# EAGLE design Un_51_V2.0 (EAGLE 7.1.0)
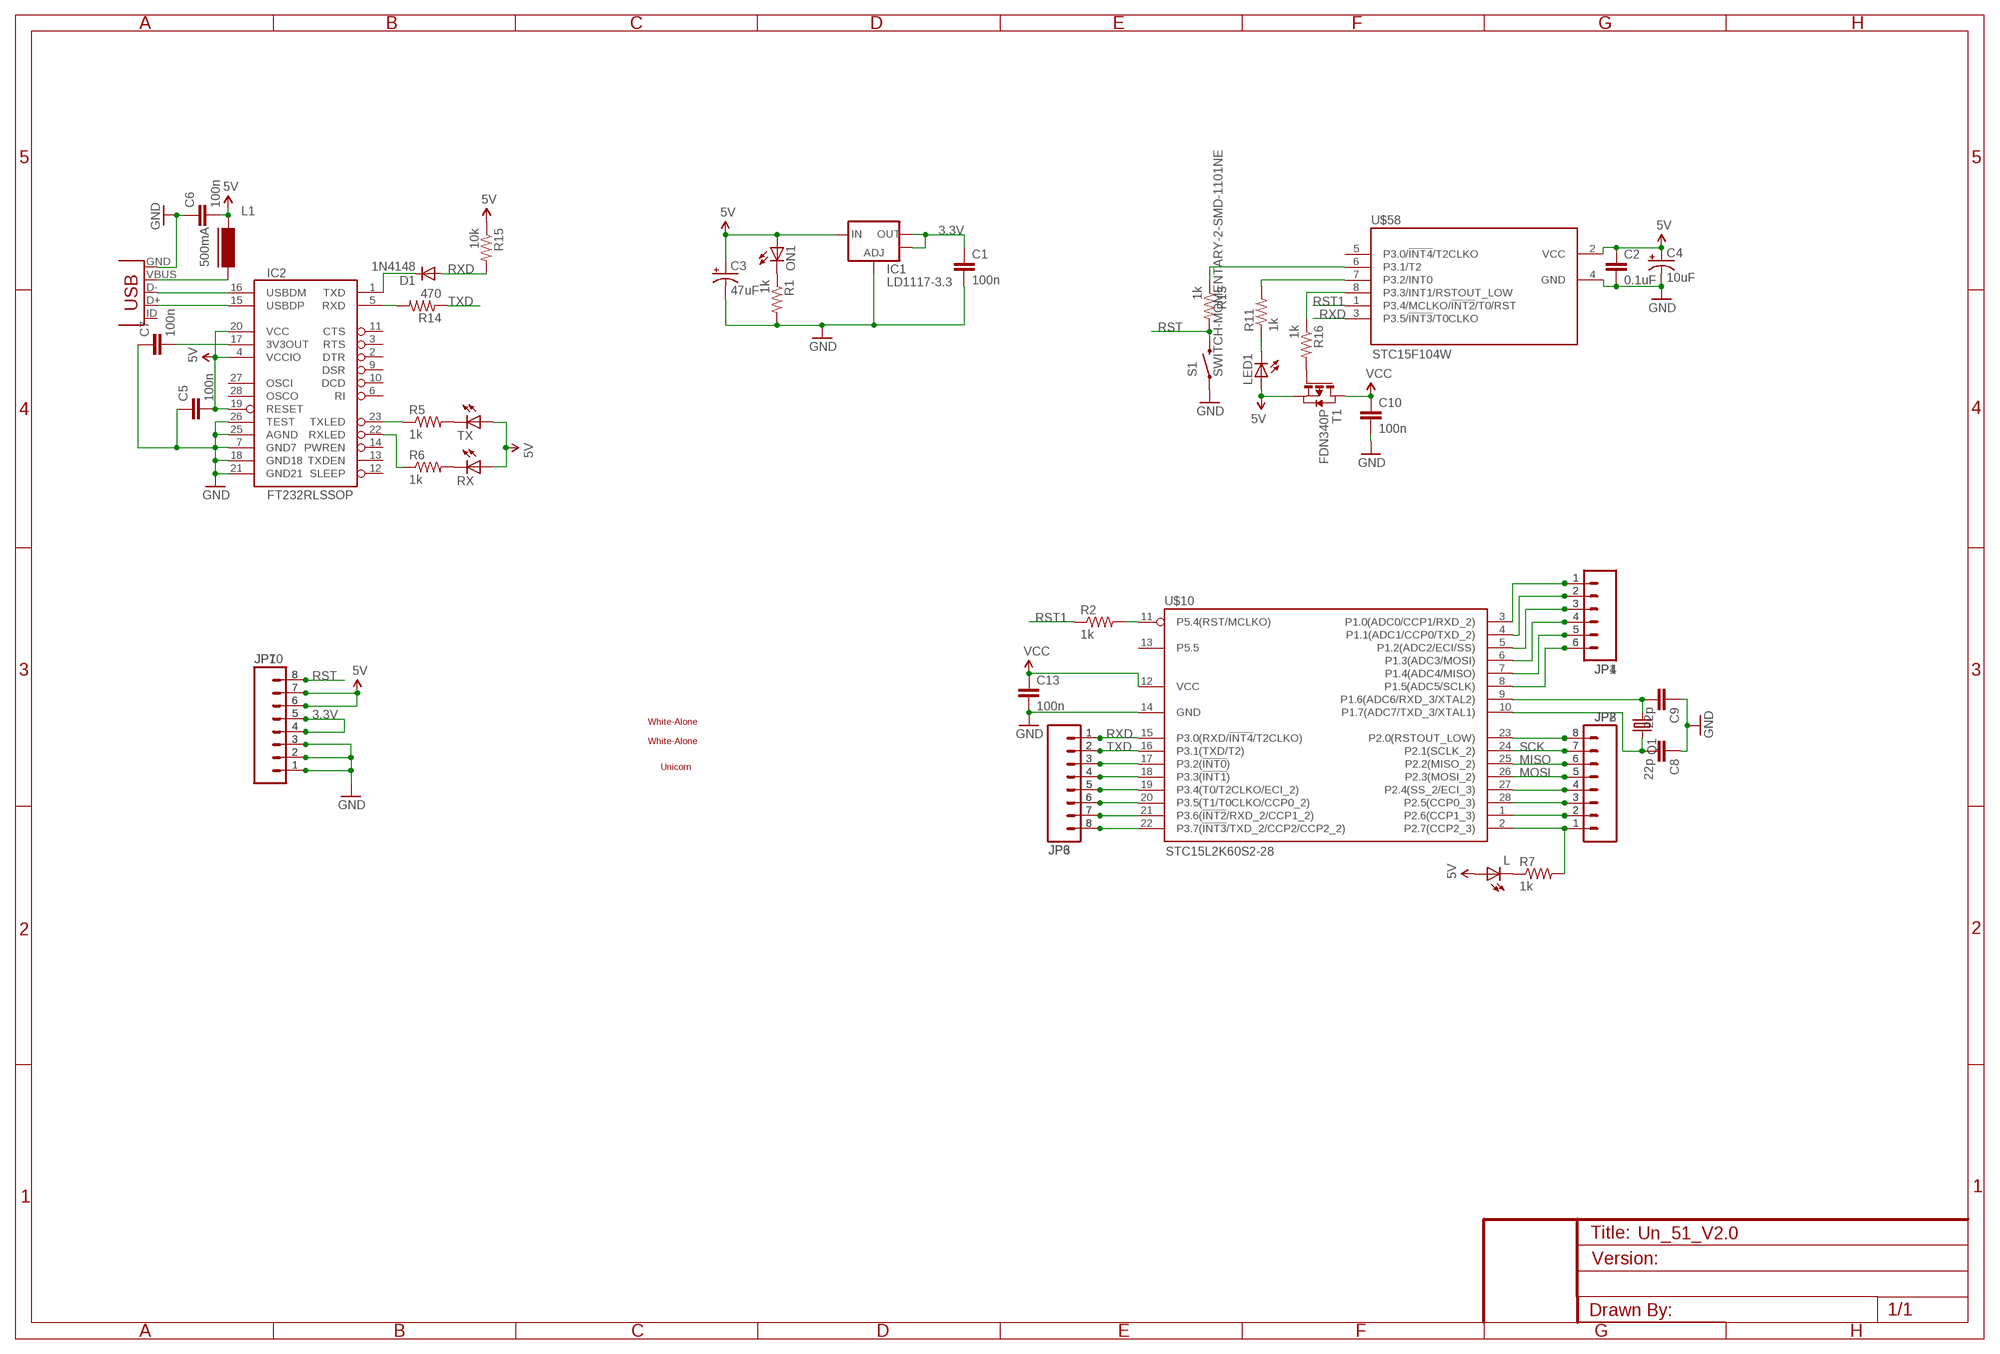
[diagram p0: schematic, sheet 1]

## Parts
C1  100n  CAP0603-CAP  [0603-CAP]
C2  0.1uF  CAP0603-CAP  [0603-CAP]
C3  47uF  CAP_POLD  [PANASONIC_D]
C4  10uF  CAP_POL1206  [EIA3216]
C5  100n  CAP0603-CAP  [0603-CAP]
C6  100n  CAP0603-CAP  [0603-CAP]
C7  100n  CAP0603-CAP  [0603-CAP]
C8  22p  CAP0603-CAP  [0603-CAP]
C9  22p  CAP0603-CAP  [0603-CAP]
C10  100n  CAP0603-CAP  [0603-CAP]
C13  100n  CAP0603-CAP  [0603-CAP]
D1  1N4148  DIODESOD  [SOD-323]
IC1  LD1117-3.3  V_REG_LM1117SOT223  [SOT223]
IC2  FT232RLSSOP  [SSOP28DB]
JP1  M06SIP  [1X06]
JP2  M08  [1X08]
JP3  M08  [1X08]
JP4  M06SIP  [1X06]
JP6  M08  [1X08]
JP7  M08  [1X08]
JP8  M08  [1X08]
JP10  M08  [1X08]
L  LED0805  [LED-0805]
L1  500mA  FERRITE-0805  [FB805]
LED1  LED0805  [LED-0805]
ON1  LED0805  [LED-0805]
Q1  CRYSTALHC49US  [HC49US]
R1  1k  RESISTOR0603-RES  [0603-RES]
R2  1k  RESISTOR0603-RES  [0603-RES]
R5  1k  RESISTOR0603-RES  [0603-RES]
R6  1k  RESISTOR0603-RES  [0603-RES]
R7  1k  RESISTOR0603-RES  [0603-RES]
R11  1k  RESISTOR0603-RES  [0603-RES]
R13  1k  RESISTOR0603-RES  [0603-RES]
R14  470  RESISTOR0603-RES  [0603-RES]
R15  10k  RESISTOR0603-RES  [0603-RES]
R16  1k  RESISTOR0603-RES  [0603-RES]
RX  LED0805  [LED-0805]
S1  SWITCH-MOMENTARY-2-SMD-1101NE  [TACTILE-SWITCH-1101NE]
T1  FDN340P  PMOSSOT23  [SOT-23]
TX  LED0805  [LED-0805]
U$3  UNICORN_1  [UNICORN_1]
U$7  WHITE-ALONE_0  [WHITE-ALONE_0]
U$10  STC15L2K60S2-28  [SO-28W]
U$11  WHITE-ALONE_0  [WHITE-ALONE_0]
U$58  STC15F104W  [SO08]
X2  USBSMD  [USB-MINIB]

## Nets
3.3V: C1.1 IC1.2(OUT) IC1.4(OUT) JP7.4 JP7.5 JP10.4 JP10.5
5V [usbvcc]: C2.1 C3.+ C4.A(+) C5.2 C6.2 IC1.3(IN) IC2.4(VCCIO) IC2.19(RESET) IC2.20(VCC) JP7.6 JP7.7 JP10.6 JP10.7 L1.1 L.1(A) LED1.1(A) ON1.1(A) R15.1 RX.1(A) T1.2(S) TX.1(A) U$58.2(VCC)
GND [gnd]: C1.2 C2.2 C3.- C4.C(-) C5.1 C6.1 C7.1 C8.1 C9.1 C10.2 C13.2 IC1.1(ADJ) IC2.7(GND7) IC2.18(GND18) IC2.21(GND21) IC2.25(AGND) IC2.26(TEST) JP7.1 JP7.2 JP7.3 JP10.1 JP10.2 JP10.3 R1.2 S1.P$1 U$10.14(GND) U$58.4(GND) X2.GND
MISO: JP2.6 JP8.6 U$10.25(P2.2(MISO_2))
MOSI: JP2.5 JP8.5 U$10.26(P2.3(MOSI_2))
N$1: JP1.6 JP4.6 U$10.8(P1.5(ADC5/SCLK))
N$2: JP1.5 JP4.5 U$10.7(P1.4(ADC4/MISO))
N$3: L1.2 X2.VBUS
N$4: LED1.2(C) R11.1
N$5: IC2.16(USBDM) X2.D-
N$6: IC2.15(USBDP) X2.D+
N$7: IC2.23(TXLED) R5.1
N$8: R5.2 TX.2(C)
N$9: R6.2 RX.2(C)
N$10: IC2.22(RXLED) R6.1
N$11: JP3.8 JP6.8 U$10.22(P3.7(!INT3!/TXD_2/CCP2/CCP2_2))
N$12: JP1.4 JP4.4 U$10.6(P1.3(ADC3/MOSI))
N$13: JP1.3 JP4.3 U$10.5(P1.2(ADC2/ECI/SS))
N$14: JP1.2 JP4.2 U$10.4(P1.1(ADC1/CCP0/TXD_2))
N$15: JP3.7 JP6.7 U$10.21(P3.6(!INT2!/RXD_2/CCP1_2))
N$16: JP2.8 JP8.8 U$10.23(P2.0(RSTOUT_LOW))
N$17: JP1.1 JP4.1 U$10.3(P1.0(ADC0/CCP1/RXD_2))
N$18: JP2.2 JP8.2 U$10.1(P2.6(CCP1_3))
N$19: JP2.1 JP8.1 R7.2 U$10.2(P2.7(CCP2_3))
N$20: R11.2 U$58.7(P3.2/INT0)
N$21: L.2(C) R7.1
N$22: C7.2 IC2.17(3V3OUT)
N$23: R2.2 U$10.11(P5.4(RST/MCLKO))
N$24: JP3.3 JP6.3 U$10.17(P3.2(!INT0!))
N$25: JP3.4 JP6.4 U$10.18(P3.3(!INT1!))
N$26: JP3.5 JP6.5 U$10.19(P3.4(T0/T2CLKO/ECI_2))
N$27: JP3.6 JP6.6 U$10.20(P3.5(T1/T0CLKO/CCP0_2))
N$28: R16.1 U$58.8(P3.3/INT1/RSTOUT_LOW)
N$29: JP2.3 JP8.3 U$10.28(P2.5(CCP0_3))
N$31: ON1.2(C) R1.1
N$32: R13.1 U$58.6(P3.1/T2)
N$35: IC2.5(RXD) R14.2
N$37: D1.1(C) IC2.1(TXD)
N$39: C8.2 Q1.2 U$10.10(P1.7(ADC7/TXD_3/XTAL1))
N$40: C9.2 Q1.1 U$10.9(P1.6(ADC6/RXD_3/XTAL2))
N$41: R16.2 T1.3(G)
N$48: JP2.4 JP8.4 U$10.27(P2.4(SS_2/ECI_3))
RST: JP7.8 JP10.8 R13.2 S1.P$2
RST1: R2.1 U$58.1(P3.4/MCLKO/!INT2!/T0/RST)
RXD: D1.2(A) JP3.1 JP6.1 R15.2 U$10.15(P3.0(RXD/!INT4!/T2CLKO)) U$58.3(P3.5/!INT3!/T0CLKO)
SCK: JP2.7 JP8.7 U$10.24(P2.1(SCLK_2))
TXD: JP3.2 JP6.2 R14.1 U$10.16(P3.1(TXD/T2))
VCC [power]: C10.1 C13.1 T1.1(D) U$10.12(VCC)
Unconnected: IC2.2(DTR) IC2.3(RTS) IC2.6(RI) IC2.9(DSR) IC2.10(DCD) IC2.11(CTS) IC2.12(SLEEP) IC2.13(TXDEN) IC2.14(PWREN) IC2.27(OSCI) IC2.28(OSCO) U$10.13(P5.5) U$58.5(P3.0/!INT4!/T2CLKO) X2.ID(USBID)

## Library data of the parts
C1 C2 C5-C10 = 2SparkFun:CAP: Capacitor Standard 0603 ceramic capacitor, and 0.1" leaded capacitor.
C3 C4 = 2SparkFun:CAP_POL: Capacitor Polarized These are standard SMD and PTH capacitors. Normally 10uF, 47uF, and 100uF in electrolytic and tantalum varieties. Always verify the external diameter of the through hole cap, it varies with capacity, voltage, and manufacturer. The EIA devices should be standard.
C13 = 1SparkFun:CAP: Capacitor Standard 0603 ceramic capacitor, and 0.1" leaded capacitor.
D1 = 2SparkFun:DIODE: Diode These are standard reverse protection diodes and small signal diodes. SMA package can handle up to about 1A. SOD-323 can handle about 200mA. What the SOD-323 package when ordering, there are some mfgs out there that are 5-pin packages.
IC1 = 1SparkFun:V_REG_LM1117: Voltage Regulator LM1117 Standard adjustable voltage regulator but in SMD form. Spark Fun Electronics SKU : COM-00595
IC2 = 1SparkFun:FT232RL: USB UART FT232RL 4th Generation USB UART (USB <-> Serial) Controller. Spark Fun Electronics SKU : COM-00650
JP1 JP4 = 2SparkFun:M06: Header 6 Standard 6-pin 0.1" header. Use with straight break away headers (SKU : PRT-00116), right angle break away headers (PRT-00553), swiss pins (PRT-00743), machine pins (PRT-00117), and female headers (PRT-00115). Molex polarized connector foot print use with SKU : PRT-08094 with associated crimp pins and housings. NOTES ON THE VARIANTS LOCK and LOCK_LONGPADS... This footprint was designed to help hold the alignment of a through-hole component (i.e. 6-pin header) while soldering it into place. You may notice that each hole has been shifted either up or down by 0.005 of an inch from it's more standard position (which is a perfectly straight line). This slight alteration caused the pins (the squares in the middle) to touch the edges of the holes. Because they are alternating, it causes a "brace" to hold the component in place. 0.005 has proven to be the perfect amount of "off-center" position when using our standard breakaway headers. Although looks a little odd when you look at the bare footprint, once you have a header in there, the alteration is very hard to notice. Also, if you push a header all the way into place, it is covered up entirely on the bottom side. This idea of altering the position of holes to aid alignment will be further integrated into the Sparkfun Library for other footprints. It can help hold any component with 3 or more connection pins.
JP2 JP3 JP6-JP8 JP10 = 1SparkFun:M08: Header 8 Standard 8-pin 0.1" header. Use with straight break away headers (SKU : PRT-00116), right angle break away headers (PRT-00553), swiss pins (PRT-00743), machine pins (PRT-00117), and female headers (PRT-00115).
L ON1 RX TX = 1SparkFun:LED: LEDs Standard schematic elements and footprints for 5mm, 3mm, 1206, and 0603 sized LEDs. 5mm - Spark Fun Electronics SKU : COM-00529 (and others)
L1 = 2SparkFun:FERRITE: Ferrite bead in various packages
LED1 = 2SparkFun:LED: LEDs Standard schematic elements and footprints for 5mm, 3mm, 1206, and 0603 sized LEDs. 5mm - Spark Fun Electronics SKU : COM-00529 (and others)
Q1 = 1SparkFun:CRYSTAL: Crystals Various standard crystals. Proven footprints. Spark Fun Electronics SKU : COM-00534
R1 R2 R5-R7 R11 R13-R16 = 2SparkFun:RESISTOR: Resistor Basic schematic elements and footprints for 0603, 1206, and PTH resistors.
S1 = 2SparkFun:SWITCH-MOMENTARY-2
T1 = zetex:PMOSSOT23: MOS FET; OC_FARNELL: unknown; OC_NEWARK: unknown
U$3 = 2SparkFun:UNICORN
U$7 U$11 = 2SparkFun:WHITE-ALONE
U$10 = 2SparkFun:STC15L2K60S2-28
U$58 = 2SparkFun:STC15F104W
X2 = 2SparkFun:USB: USB Connectors USB-B-PTH is fully proven SKU : PRT-00139 USB-miniB is fully proven SKU : PRT-00587 USB-A-PCB is untested. USB-A-H is throughly reviewed, but untested. Spark Fun Electronics SKU : PRT-00437 USB-B-SMT is throughly reviewed, but untested. Needs silkscreen touching up. USB-A-S has not been used/tested USB-MB-H has not been used/tested

## Net classes
0 default: width 0.254 mm, clearance 0.254 mm
1 power: width 0.61 mm, drill 0.61 mm, clearance 0.254 mm
2 gnd: width 0.305 mm, drill 0.381 mm, clearance 0.254 mm
3 usbvcc: width 0.508 mm, drill 0.61 mm, clearance 0.254 mm
4 aref: width 0.406 mm, drill 0.61 mm, clearance 0.254 mm

## Board
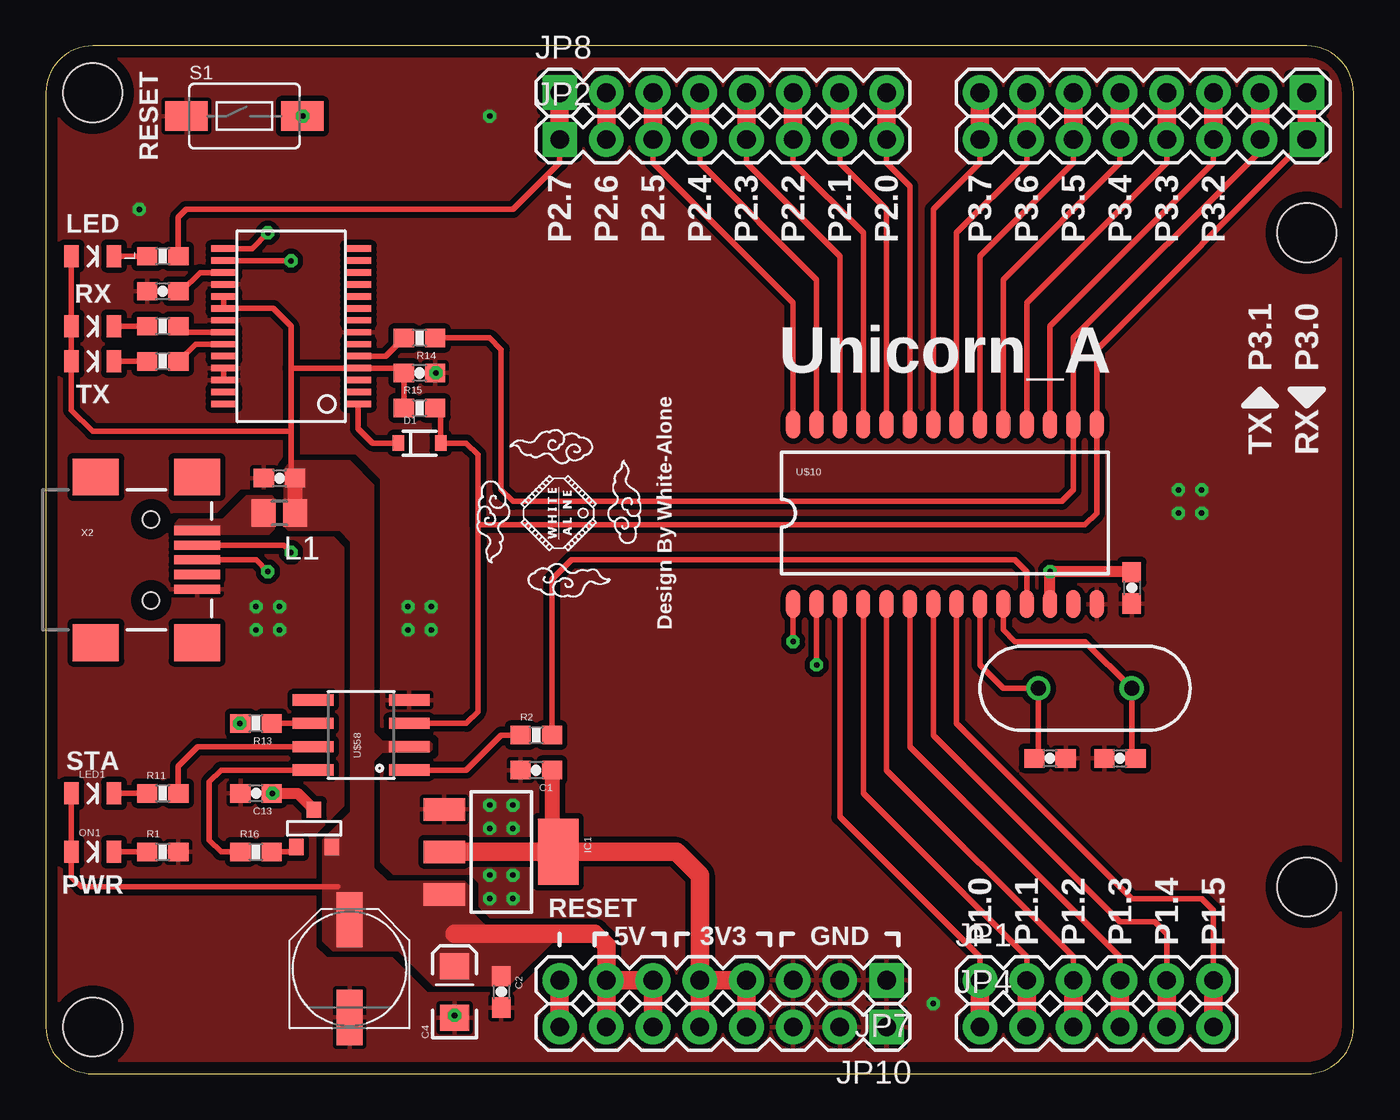
[diagram p1: board, top side]
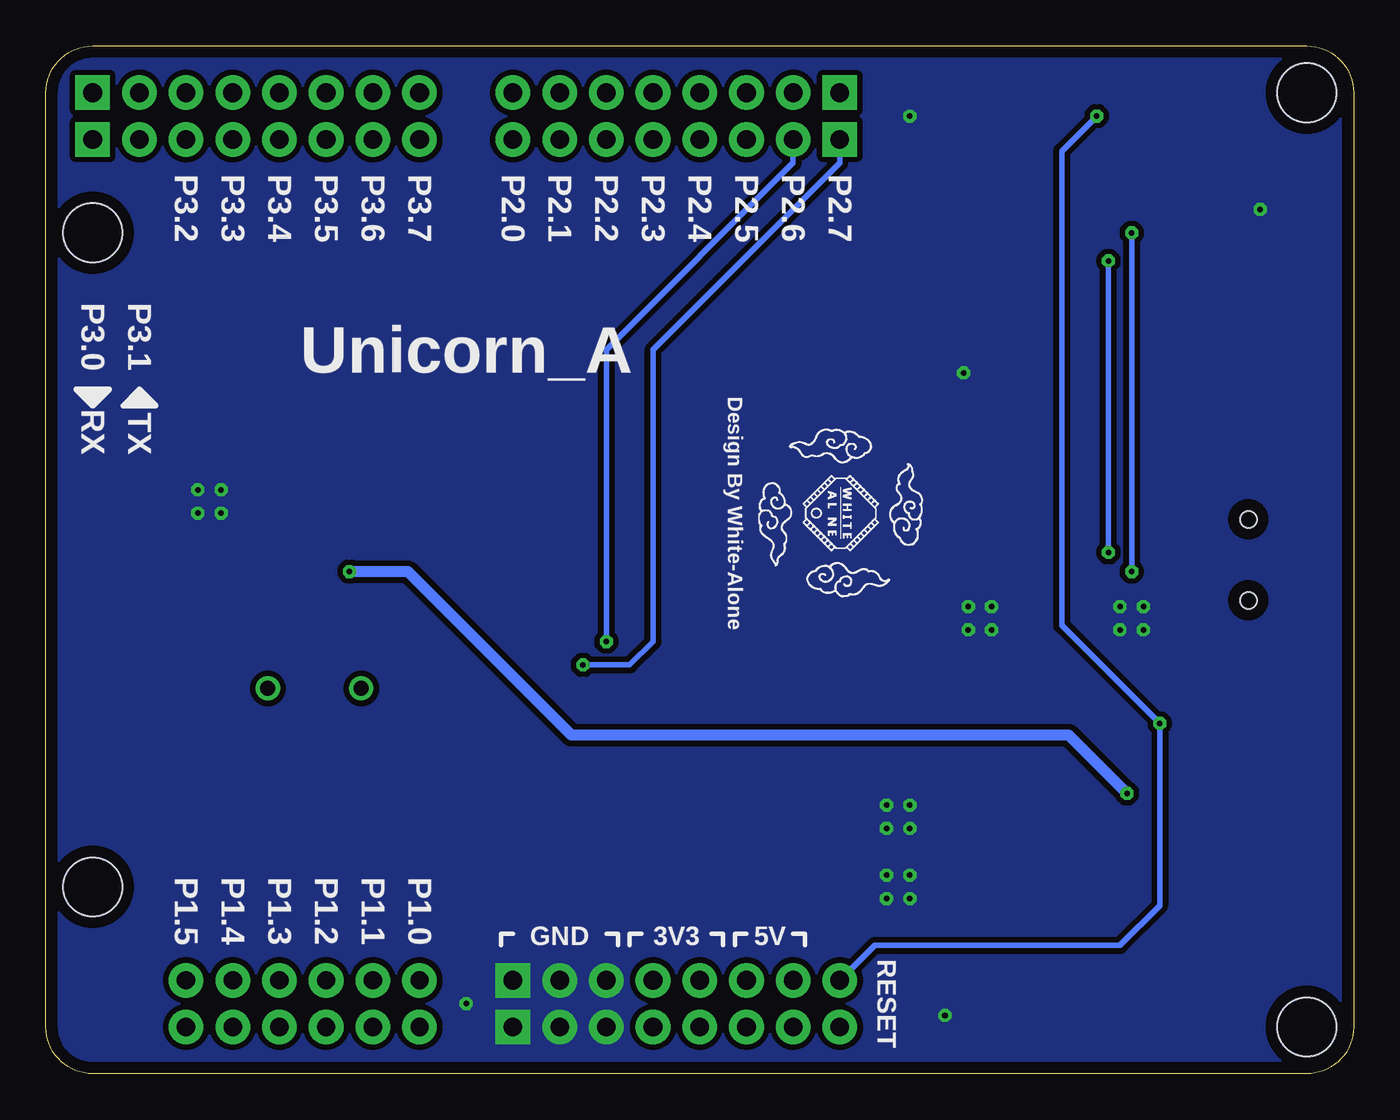
[diagram p2: board, bottom side, seen from below]

Size 71.12 x 55.88 mm. Coordinates in mm from the lower left corner, seen from the top.
Copper layers (1*16): Top 0.035mm / dielectric 1.5mm / Bottom 0.035mm
Design rules "yun": minimum track width 8mil, minimum drill 15mil, track to track 8mil, track to pad 8mil, pad to pad 8mil, via to via 8mil, smd to smd 8mil, copper to edge 25mil, drill to drill 8mil, minimum pad ring 10mil, minimum via ring 8mil, stop-mask expansion 4mil, vias tented up to drill 20mil, thermal gap 8mil

### Footprints (pad centres in the part's own frame; a part is rotated, then mirrored left to right if it is on the bottom)
0603-CAP = smd 1.1 x 1: 1 -0.85,0; 2 0.85,0
PANASONIC_D = smd 3 x 1.4: + 2.654,0; - -2.654,0
EIA3216 = smd 1.4 x 1.6: A 1.4,0; C -1.4,0
SOD-323 = smd 0.63 x 0.83: 1 -1.15,0; 2 1.15,0
SOT223 = smd 1.219 x 2.235: 1 -2.311,-3.099; 2 0,-3.099; 3 2.311,-3.099 | smd 3.6 x 2.2: 4 0,3.099
SSOP28DB = smd 0.348 x 1.397: 1 -4.225,-3.656; 2 -3.575,-3.656; 3 -2.925,-3.656; 4 -2.275,-3.656; 5 -1.625,-3.656; 6 -0.975,-3.656; 7 -0.325,-3.656; 8 0.325,-3.656; 9 0.975,-3.656; 10 1.625,-3.656; 11 2.275,-3.656; 12 2.925,-3.656; 13 3.575,-3.656; 14 4.225,-3.656; 15 4.225,3.656; 16 3.575,3.656; 17 2.925,3.656; 18 2.275,3.656; 19 1.625,3.656; 20 0.975,3.656; 21 0.325,3.656; 22 -0.325,3.656; 23 -0.975,3.656; 24 -1.625,3.656; 25 -2.275,3.656; 26 -2.925,3.656; 27 -3.575,3.656; 28 -4.225,3.656
1X06 = drill 1 pad 1.88: 1 0,0; 2 2.54,0; 3 5.08,0; 4 7.62,0; 5 10.16,0; 6 12.7,0
1X08 = drill 1.016 pad 1.88 square: 1 0,0 | drill 1.016 pad 1.88: 2 2.54,0; 3 5.08,0; 4 7.62,0; 5 10.16,0; 6 12.7,0; 7 15.24,0; 8 17.78,0
LED-0805 = smd 0.8 x 1.2: 1 -1.154,0; 2 1.154,0
FB805 = smd 1.3 x 1.5: 1 -0.85,0; 2 0.85,0
HC49US = drill 0.813: 1 -2.54,0; 2 2.54,0
0603-RES = smd 1.1 x 1: 1 -0.85,0; 2 0.85,0
TACTILE-SWITCH-1101NE = smd 2.3 x 1.6: P$1 -3.15,0; P$2 3.15,0
SOT-23 = smd 0.787 x 0.889: 1 0.025,-1.016; 2 -0.94,1.016; 3 0.991,1.016
UNICORN_1 = hole 3.2: -33.02,-25.4; 33.02,17.78; 33.02,-17.78; -33.02,25.4
SO-28W = smd 0.762 x 1.524: 1 -8.255,-4.953; 2 -6.985,-4.953; 3 -5.715,-4.953; 4 -4.445,-4.953; 5 -3.175,-4.953; 6 -1.905,-4.953; 7 -0.635,-4.953; 8 0.635,-4.953; 9 1.905,-4.953; 10 3.175,-4.953; 11 4.445,-4.953; 12 5.715,-4.953; 13 6.985,-4.953; 14 8.255,-4.953; 15 8.255,4.826; 16 6.985,4.826; 17 5.715,4.826; 18 4.445,4.826; 19 3.175,4.826; 20 1.905,4.826; 21 0.635,4.826; 22 -0.635,4.826; 23 -1.905,4.826; 24 -3.175,4.826; 25 -4.445,4.826; 26 -5.715,4.826; 27 -6.985,4.826; 28 -8.255,4.826
SO08 = smd 0.61 x 2.21: 1 -1.905,-2.616; 2 -0.635,-2.616; 3 0.635,-2.616; 4 1.905,-2.616; 5 1.905,2.616; 6 0.635,2.616; 7 -0.635,2.616; 8 -1.905,2.616
USB-MINIB = smd 2.5 x 0.5: D+ 2.5,0; D- 2.5,0.8; GND 2.5,-1.6; ID 2.5,-0.8; VBUS 2.5,1.6 | smd 2.5 x 2: MTN1 -3,4.5; MTN2 2.5,4.5; MTN3 -3,-4.5; MTN4 2.5,-4.5 | hole 0.9: 0,2.2; 0,-2.2

### Placement (x,y rotation side)
C1  26.67,16.51 180 top
C2  24.77,4.45 270 top
C3  16.51,5.71 90 top
C4  22.23,4.45 90 top
C5  20.32,38.1 180 top
C6  12.7,32.38 0 top
C7  6.35,42.55 0 top
C8  58.42,17.14 0 top
C9  54.61,17.14 180 top
C10  59.05,26.42 270 top
C13  11.43,15.24 180 top
D1  20.32,34.29 0 top
IC1  24.77,12.06 270 top
IC2  13.34,40.64 90 top
JP1  50.8,5.08 0 top
JP2  27.94,50.8 0 top
JP3  68.58,53.34 180 top
JP4  50.8,2.54 0 top
JP6  68.58,50.8 180 top
JP7  45.72,5.08 180 top
JP8  27.94,53.34 0 top
JP10  45.72,2.54 180 top
L  2.54,44.45 0 top
L1  12.7,30.48 180 top
LED1  2.54,15.24 0 top
ON1  2.54,12.06 0 top
Q1  56.52,20.95 0 top
R1  6.35,12.06 0 top
R2  26.67,18.41 0 top
R5  6.35,38.73 180 top
R6  6.35,40.64 180 top
R7  6.35,44.45 0 top
R11  6.35,15.24 0 top
R13  11.43,19.05 180 top
R14  20.32,40.01 180 top
R15  20.32,36.2 0 top
R16  11.43,12.06 0 top
RX  2.54,40.64 0 top
S1  10.79,52.07 0 top
T1  14.61,13.34 180 top
TX  2.54,38.73 0 top
U$3  35.56,27.94 0 top
U$7  27.94,30.48 90 top
U$10  48.9,30.48 0 top
U$11  27.94,30.48 270 bottom
U$58  17.14,18.41 90 top
X2  5.71,27.94 0 top

### Tracks (layer width: path | path; a pad name or v marks a point on that pad's centre or on a via)
3.3V
  Top 0.813: C1.1 27.52,12.28 27.3,12.06
  Top 1.016: IC1.2 27.3,12.06 IC1.4 34.29,12.06 35.56,10.79 JP7.5 | JP7.5 JP7.4 JP10.4 | JP10.5 JP7.5
5V
  Top 0.305: R15.1 C5.2 19.2,38.37 IC2.4 13.34,38.37 | IC2.19 IC2.20 12.36,41.62 13.34,40.64 13.34,38.37 | L.1 RX.1 TX.1 1.39,36.08 2.54,34.92 13.34,34.92 | 13.34,38.37 13.34,34.92 | 13.34,34.92 13.34,32.6 C6.2 | LED1.1 ON1.1 1.39,10.68 1.91,10.16 15.88,10.16
  Top 0.813: L1.1 C6.2
  Top 1.016: JP10.6 JP7.6 JP7.7 | JP10.7 JP7.7 | JP7.7 30.48,6.99 29.84,7.62 22.23,7.62
  pour Top (isolate 0.305, no thermals): 15.62,6.73 19.18,6.73 21.08,4.83 25.15,4.83 27.81,7.49 27.81,8 23.88,8 23.11,8.76 23.11,10.03 22.73,10.41 18.54,10.41 17.78,11.18 17.78,17.02 18.29,17.53 20.83,17.53 20.95,17.65 20.95,17.91 20.83,18.03 18.29,18.03 17.78,18.54 17.78,32 16.51,33.27 13.34,33.27 13,32.84 13,29.79 13.21,29.59 16,29.59 16.64,28.96 16.64,14.22 15.11,12.7 15.11,7.24
GND  (via drill 0.3)
  Top 0.305: IC2.25 IC2.26
  other vias: 22.23,3.17 24.13,13.34 25.4,13.34 24.13,10.79 25.4,10.79 21.21,38.1 24.13,14.61 25.4,14.61 24.13,9.53 25.4,9.53 24.13,52.07 48.26,3.81 61.59,31.75 62.87,30.48 61.59,30.48 5.08,46.99 11.43,25.4 12.7,25.4 11.43,24.13 12.7,24.13 19.68,24.13 20.95,24.13 20.95,25.4 19.68,25.4 62.87,31.75
  pour Bottom (isolate 0.305, rank 2, no thermals): 0,0 71.12,0 71.12,55.88 0,55.88
  pour Top (isolate 0.305, rank 2): 0,0 71.12,0 71.12,55.88 0,55.88
MISO
  Top 0.305: U$10.25 44.45,45.72 40.64,49.53 JP2.6
  Top 1.016: JP2.6 JP8.6
MOSI
  Top 0.305: U$10.26 43.18,44.45 38.1,49.53 JP2.5
  Top 1.016: JP2.5 JP8.5
N$1
  Top 0.305: U$10.8 49.53,19.05 59.05,9.53 62.87,9.53 63.5,8.89 JP1.6
  Top 1.016: JP4.6 JP1.6
N$2
  Top 0.305: U$10.7 48.26,18.41 58.42,8.26 60.33,8.26 60.96,7.62 JP1.5
  Top 1.016: JP4.5 JP1.5
N$3
  pour Top (isolate 0.305, no thermals): 7.09,29.39 12.12,29.39 12.37,29.64 12.4,31.24 12.27,31.37 10.92,31.37 9.65,30.1 7.24,30.1 7.09,29.9
N$4
  Top 0.305: LED1.2 R11.1
N$5  (via drill 0.3)
  Top 0.305: IC2.16 13.32,44.22 v13.34,44.2 | X2.D- 12.94,28.74 v13.34,28.35
  Bottom 0.305: v13.34,28.35 v13.34,44.2
N$6  (via drill 0.3)
  Top 0.305: X2.D+ 11.43,27.94 v12.06,27.3 | IC2.15 11.21,44.87 v12.06,45.72
  Bottom 0.305: v12.06,27.3 v12.06,45.72
N$7
  Top 0.305: IC2.23 8.13,39.66 R5.1
N$8
  Top 0.305: TX.2 R5.2
N$9
  Top 0.305: RX.2 R6.2
N$10
  Top 0.305: IC2.22 7.53,40.31 R6.1
N$11
  Top 0.305: U$10.22 48.26,46.99 50.8,49.53 JP6.8
  Top 1.016: JP3.8 JP6.8
N$12
  Top 0.305: U$10.6 46.99,17.78 58.42,6.35 JP1.4
  Top 1.016: JP4.4 JP1.4
N$13
  Top 0.305: U$10.5 45.72,16.51 55.88,6.35 JP1.3
  Top 1.016: JP4.3 JP1.3
N$14
  Top 0.305: U$10.4 44.45,15.24 53.34,6.35 JP1.2
  Top 1.016: JP4.2 JP1.2
N$15
  Top 0.305: U$10.21 49.53,45.72 53.34,49.53 JP6.7
  Top 1.016: JP3.7 JP6.7
N$16
  Top 0.305: U$10.23 46.99,48.26 45.72,49.53 JP2.8
  Top 1.016: JP2.8 JP8.8
N$17
  Top 0.305: U$10.3 43.18,13.97 50.8,6.35 JP1.1
  Top 1.016: JP4.1 JP1.1
N$18  (via drill 0.3)
  Top 0.305: U$10.1 v40.64,23.5
  Top 1.016: JP2.2 JP8.2
  Bottom 0.305: v40.64,23.5 40.64,39.37 30.48,49.53 JP2.2
N$19  (via drill 0.3)
  Top 0.305: U$10.2 v41.91,22.23 | R7.2 7.2,46.57 7.62,46.99 25.4,46.99 27.94,49.53 JP2.1
  Top 1.016: JP2.1 JP8.1
  Bottom 0.305: v41.91,22.23 39.37,22.23 38.1,23.5 38.1,39.37 27.94,49.53 JP2.1
N$20
  Top 0.305: U$58.7 8.26,17.78 7.2,16.73 R11.2
N$21
  Top 0.305: L.2 R7.1
N$22
  Top 0.305: C7.2 7.37,42.55 8.38,43.56 IC2.17
N$23
  Top 0.305: U$10.11 53.34,27.3 52.7,27.94 28.57,27.94 27.52,26.89 R2.2
N$24
  Top 0.305: U$10.17 54.61,40.64 63.5,49.53 JP6.3
  Top 1.016: JP3.3 JP6.3
N$25
  Top 0.305: U$10.18 53.34,41.91 60.96,49.53 JP6.4
  Top 1.016: JP3.4 JP6.4
N$26
  Top 0.305: U$10.19 52.07,43.18 58.42,49.53 JP6.5
  Top 1.016: JP3.5 JP6.5
N$27
  Top 0.305: U$10.20 50.8,44.45 55.88,49.53 JP6.6
  Top 1.016: JP3.6 JP6.6
N$28
  Top 0.305: U$58.8 9.53,16.51 8.89,15.88 8.89,12.7 9.53,12.06 R16.1
N$29
  Top 0.305: U$10.28 40.64,41.91 33.02,49.53 JP2.3
  Top 1.016: JP2.3 JP8.3
N$31
  Top 0.305: ON1.2 R1.1
N$32
  Top 0.305: U$58.6 R13.1
N$35
  Top 0.305: IC2.5 18.48,39.02 R14.2
N$37
  Top 0.305: IC2.1 16.99,35.08 17.78,34.29 D1.1
N$39
  Top 0.305: U$10.10 52.07,24.13 52.7,23.5 56.52,23.5 Q1.2 59.05,17.36 C8.2
N$40
  Top 0.305: U$10.9 50.8,22.23 52.07,20.95 Q1.1 53.98,17.36 C9.2
N$41
  Top 0.305: R16.2 13.36,12.06 T1.3
N$48
  Top 0.305: U$10.27 41.91,43.18 35.56,49.53 JP2.4
  Top 1.016: JP2.4 JP8.4
RST  (via drill 0.3)
  Top 0.305: v10.54,19.05 R13.2 | v13.97,52.07 S1.P$2
  Top 1.016: JP10.8 JP7.8
  Bottom 0.305: JP7.8 26.04,6.99 12.7,6.99 10.54,9.14 v10.54,19.05 15.88,24.38 15.88,50.16 v13.97,52.07
RST1
  Top 0.305: R2.1 24.77,18.41 22.86,16.51 U$58.1
RXD
  Top 0.305: R15.2 21.47,35.9 D1.2 22.86,34.29 23.5,33.66 23.5,29.84 | 23.5,29.84 56.52,29.84 57.15,30.48 U$10.15 57.15,39.37 JP6.1 | 23.5,29.84 23.5,19.68 22.86,19.05 U$58.3
  Top 1.016: JP3.1 JP6.1
SCK
  Top 0.305: U$10.24 45.72,46.99 43.18,49.53 JP2.7
  Top 1.016: JP2.7 JP8.7
TXD
  Top 0.305: R14.1 24.13,40.01 24.77,39.37 24.77,31.75 25.4,31.11 55.24,31.11 55.88,31.75 U$10.16 55.88,40.01 66.04,50.16 JP6.2
  Top 1.016: JP3.2 JP6.2
VCC  (via drill 0.3)
  Top 0.61: C10.1 58.89,27.3 v54.61,27.3 U$10.12 | C13.1 v12.32,15.24 13.69,15.24 T1.1
  Bottom 0.61: v12.32,15.24 15.49,18.41 42.55,18.41 51.44,27.3 v54.61,27.3

### Text on the board
tPlace: RESET | P2.7 | P2.6 | P2.5 | P2.4 | P2.3 | P2.2 | P2.1 | P2.0 | P3.7 | P3.6 | P3.5 | P3.4 | P3.3 | P3.2 | LED | RX | P3.1 | P3.0 | Unicorn_A | TX | TX | RX | Design By White-Alone | STA | PWR | RESET | 5V | 3V3 | GND | P1.0 | P1.1 | P1.2 | P1.3 | P1.4 | P1.5
bPlace: P2.7 | P2.6 | P2.5 | P2.4 | P2.3 | P2.2 | P2.1 | P2.0 | P3.7 | P3.6 | P3.5 | P3.4 | P3.3 | P3.2 | P3.1 | P3.0 | Unicorn_A | TX | RX | Design By White-Alone | 5V | 3V3 | GND | P1.0 | P1.1 | P1.2 | P1.3 | P1.4 | P1.5 | RESET